# EAGLE schematic atividade_02 (EAGLE 9.7.0)
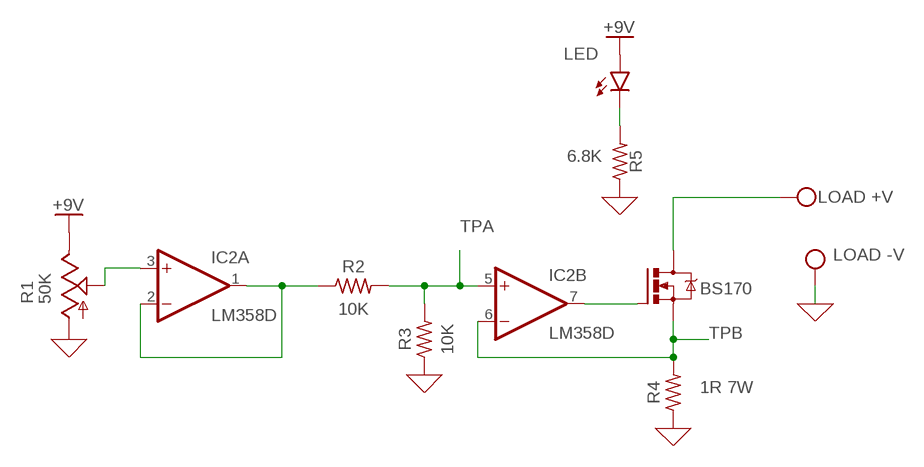
[diagram p0: schematic, sheet 1]

## Parts
IC2  LM358D  [SO08]
LED  LAP4-BOTTOM  [P47F-BOTTOM]
Q1  BS170  NMOSFET_BS170-TO92  [TO92]
R1  50K  TRIM_US-B25P  [B25P]
R2  10K  R-US_AXIAL-7.2MM-PITCH  [RESAD724W46L381D178B]
R3  10K  R-US_AXIAL-7.2MM-PITCH  [RESAD724W46L381D178B]
R4  1R 7W  R-US_AXIAL-7.2MM-PITCH  [RESAD724W46L381D178B]
R5  6.8K  R-US_AXIAL-7.2MM-PITCH  [RESAD724W46L381D178B]

## Nets
0: R1.A R3.1 R4.1 R5.1 ; supply symbol labelled GND, LOAD -V
+9V: LED.A R1.E
+V: Q1.1(D) ; supply symbol labelled LOAD +V
N$1: IC2.3(A:+IN) R1.S
N$2: IC2.1(A:OUT) IC2.2(A:-IN) R2.1
N$3: LED.C R5.2
N$4: IC2.7(B:OUT) Q1.2(G)
TPA: IC2.5(B:+IN) R2.2 R3.2
TPB: IC2.6(B:-IN) Q1.3(S) R4.2

## Power pins joined to a net without a drawn wire
V+: IC2.8(P:V+)
V-: IC2.4(P:V-)

## Library data of the parts
IC2 = linear:LM358: OP AMP also LM158; LM258; LM2904 Source: http://cache.national.com/ds/LM/LM158.pdf
LED = led:*P4: PointLED® Enhanced Thinfilm LED TOP & BOTTOM mount LS P47F, LR P47F, LA P47F, LY P47F, LT P4SG, LB P4SG, LW P4SG Source: http://catalog.osram-os.com .. LA_LR_LS_LY_P47F_Pb_free.pdf
Q1 = Transistor:NMOSFET_: N-Channel MOSFET - Popular parts; CATEGORY: Transistor; DESCRIPTION: MOSFET N-CH 60V 500MA TO-92; DRAIN_CURRENT: 500mA; MANUFACTURER: ON Semiconductor; MPN: BS170; OPERATING_TEMP: -55°C ~ 150°C; PART_STATUS: Active; ROHS_COMPLIANT: Yes; SUB-CATEGORY: MOSFET; THERMALLOSS: 830mW; TYPE: N-Channel; VALUE: BS170
R1 = pot:TRIM_US-: POTENTIOMETER
R2-R5 = Resistor:R-US: Resistor Fixed - ANSI; CATEGORY: Resistor; SUB-CATEGORY: Fixed